# Altium schematic sheet MCU.SchDoc
size A3; SheetNumber: 4; SheetTotal: 6
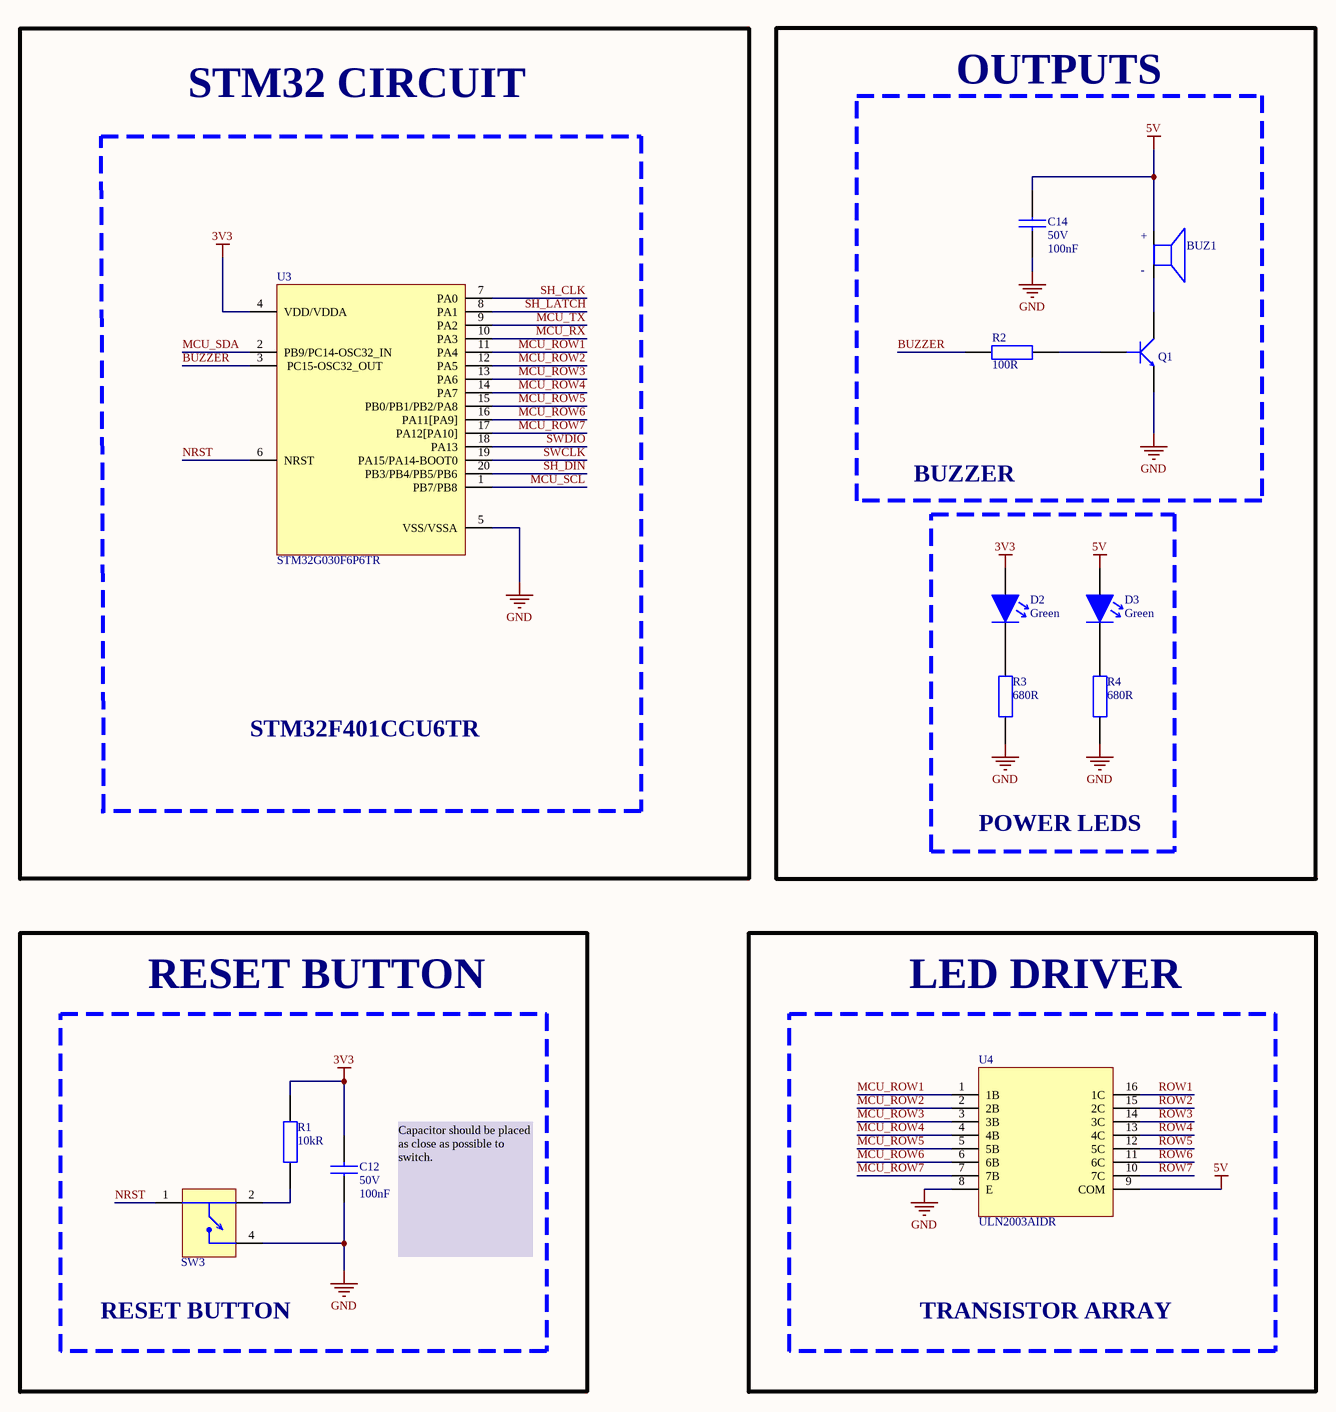
[diagram p0: MCU.SchDoc]

## Parts
BUZ1  SMI-1027-TW-5V-R  [BUZZER_SMD]  (value not drawn)
C12  Voltage Rating (DC): 50V  Capacitance: 100nF  [CAP_0603]  (hidden comment: C0603C104K5RACTU)
C14  Voltage Rating (DC): 50V  Capacitance: 100nF  [CAP_0603]  (hidden comment: C0603C104K5RACTU)
D2  Color: Green  [LED_GREEN_0805]  (hidden comment: LTST-C171GKT)
D3  Color: Green  [LED_GREEN_0805]  (hidden comment: LTST-C171GKT)
Q1  MMBT3904-7-F  [SOT-23F]  (value not drawn)
R1  Resistance: 10kR  [RES_0805]  (hidden comment: RC0805JR-0710KL)
R2  Resistance: 100R  [RES_0603]  (hidden comment: RC0603JR-07100RL)
R3  Resistance: 680R  [RES_1206]  (hidden comment: RC1206FR-07680RL)
R4  Resistance: 680R  [RES_1206]  (hidden comment: RC1206FR-07680RL)
SW3  PTS815 SJK 250 SMTR LFS  [BUTTON SMD]  (value not drawn)
U3  STM32G030F6P6TR  [TSSOP20]
U4  ULN2003AIDR  [16-SOIC]

## Blocks framed on the sheet
BUZZER: BUZ1 C14 Q1 R2
STM32F401CCU6TR: U3
POWER LEDS: D2 D3 R3 R4
RESET BUTTON: C12 R1 SW3
TRANSISTOR ARRAY: U4

## Nets
3V3: C12.2 D2.1 R1.2 U3.4(VDD/VDDA)
5V: BUZ1.P(POS) C14.1 D3.1 U4.9(COM)
GND: C12.1 C14.2 Q1.2(E) R3.1 R4.1 SW3.4 U3.5(VSS/VSSA) U4.8(E)
BUZZER: R2.1 U3.3(PC15-OSC32_OUT)
MCU_ROW1: U3.11(PA4) U4.1(1B)
MCU_ROW2: U3.12(PA5) U4.2(2B)
MCU_ROW3: U3.13(PA6) U4.3(3B)
MCU_ROW4: U3.14(PA7) U4.4(4B)
MCU_ROW5: U3.15(PB0/PB1/PB2/PA8) U4.5(5B)
MCU_ROW6: U3.16(PA11[PA9]) U4.6(6B)
MCU_ROW7: U3.17(PA12[PA10]) U4.7(7B)
MCU_RX: U3.10(PA3)
MCU_SCL: U3.1(PB7/PB8)
MCU_SDA: U3.2(PB9/PC14-OSC32_IN)
MCU_TX: U3.9(PA2)
NRST: SW3.1 U3.6(NRST)
ROW1: U4.16(1C)
ROW2: U4.15(2C)
ROW3: U4.14(3C)
ROW4: U4.13(4C)
ROW5: U4.12(5C)
ROW6: U4.11(6C)
ROW7: U4.10(7C)
SH_CLK: U3.7(PA0)
SH_DIN: U3.20(PB3/PB4/PB5/PB6)
SH_LATCH: U3.8(PA1)
SWCLK: U3.19(PA15/PA14-BOOT0)
SWDIO: U3.18(PA13)
NetBUZ1_N: BUZ1.N(NEG) Q1.3(C)
NetD2_2: D2.2 R3.2
NetD3_2: D3.2 R4.2
NetQ1_1: Q1.1(B) R2.2
NetR1_1: R1.1 SW3.2

## Notes on the sheet
- STM32 CIRCUIT
- OUTPUTS
- RESET BUTTON
- LED DRIVER
- Capacitor should be placed as close as possible to switch.
- DOSYA ADI / FILE NAME
- TANIM / DESCRIPTION
- HAZIRLAYAN / PREPARED BY
- YAYIN TARİHİ / REL. DATE
- BOYUT / SIZE
- SAYFA / SHEET
- /
- (in symbol BUZZER_5V_SMD) +; -

## Library data of the parts
BUZ1 = BUZZER_5V_SMD: Audio Indicator 5V 30mA 80dBA 2.7KHz Resonant Frequency SMD; Manufacturer: Projects Unlimited; DesignedBy: Aslı Kurt; Supplier 1: Farnell; Manufacturer Part Number: SMI-1027-TW-5V-R; RoHS: Yes; Category: Audio Products; Stock 1: 586; Pricing 1: 1=3,65, 10=2,48, 50=2,34, 100=2,19, 200=2,04, 600=2, 3000=1,96, 6000=1,92 (EUR); ComponentLink1URL: http://www.puiaudio.com/pdf/SMI-1027-TW-5V-R.pdf?src-supplier=Digikey; ComponentLink1Description: http://www.puiaudio.com/pdf/SMI-1027-TW-5V-R.pdf?src-supplier=Digikey; ComponentLink2URL: https://datasheet.octopart.com/SMI-1027-TW-5V-R-PUI-Audio-datasheet-142096096.pdf?src-supplier=Sager+Electronics; ComponentLink2Description: https://datasheet.octopart.com/SMI-1027-TW-5V-R-PUI-Audio-datasheet-142096096.pdf?src-supplier=Sager+Electronics; Supplier 2: Farnell; Stock 2: 586; Pricing 2: 150=2,19, 200=2,04, 600=2, 3000=1,96, 6000=1,92 (EUR); Supplier 3: Mouser; Stock 3: 655; Pricing 3: 1=3,48, 10=2,88, 50=2,5, 100=2,34, 1000=2,12, 10000=2,09 (USD); Supplier 4: Digikey; Stock 4: 10957; Pricing 4: 1=3,48, 10=2,877, 25=2,6548, 50=2,4932, 100=2,338, 250=2,17212, 600=1,92018 (USD); Supplier Part Number 1: 4411206; Supplier Part Number 2: 4411206RL; Supplier Part Number 3: 665-SMI1027TW5VR; Supplier Part Number 4: 668-1537-1-ND
C12 C14 = CAP CER 100nF 0603: CAP CER 100nF %10 0603 SMD; Manufacturer: KEMET; DesignedBy: Aslı Kurt; Dielectric Material: Ceramic; Tolerance: 10%; Dielectric: X7R; Dissipation Factor: 2.5%; Supplier 1: Digi-Key; Manufacturer Part Number: C0603C104K5RACTU; RoHS: Yes; Category: Ceramic Capacitors; Stock 1: 1666186; Pricing 1: 1=0,12000, 10=0,08500, 50=0,04620, 100=0,03770, 500=0,02696, 1000=0,02118 (USD); Mount: Surface Mount; Case/Package: 0603; Number of Pins: 2; Case Code (Metric): 1608; Case Code (Imperial): 0603; Contact Plating: Tin,Matte; Min Operating Temperature: -55°C; Max Operating Temperature: 125°C; Packaging: Tape and Reel; Package Quantity: 1; Termination: SMD/SMT; Voltage: 50V; Voltage Rating: 50V; Series: SMD Comm X7R; Length: 0.063inch; Width: 0.031inch; Height: 0.8mm; Thickness: 0.034inch; Lead Pitch: 0.7mm; Depth: 0.8mm; Radiation Hardening: No; RoHS Compliant: Yes; REACH SVHC: No SVHC; ComponentLink1URL: https://datasheet.ciiva.com/7823/kem-c1002-x7r-smd-7823591.pdf?src-supplier=Element14; ComponentLink1Description: https://datasheet.ciiva.com/7823/kem-c1002-x7r-smd-7823591.pdf?src-supplier=Element14; ComponentLink2URL: https://datasheet.ciiva.com/14602/70095383-14602583.pdf?src-supplier=Allied+Electronics; ComponentLink2Description: https://datasheet.ciiva.com/14602/70095383-14602583.pdf?src-supplier=Allied+Electronics; ComponentLink3URL: https://datasheet.ciiva.com/5999/kem-c1002-x7r-smd-5999400.pdf?src-supplier=Farnell; ComponentLink3Description: https://datasheet.ciiva.com/5999/kem-c1002-x7r-smd-5999400.pdf?src-supplier=Farnell; ComponentLink4URL: https://datasheet.ciiva.com/7823/kem-c1002-x7r-smd-7823592.pdf?src-supplier=Element14; ComponentLink4Description: https://datasheet.ciiva.com/7823/kem-c1002-x7r-smd-7823592.pdf?src-supplier=Element14; ComponentLink5URL: https://datasheet.ciiva.com/28645/1851736-28645640.pdf?src-supplier=Element14; ComponentLink5Description: https://datasheet.ciiva.com/28645/1851736-28645640.pdf?src-supplier=Element14; ComponentLink6URL: https://datasheet.ciiva.com/14585/70095383-14585209.pdf?src-supplier=Allied+Electronics; ComponentLink6Description: https://datasheet.ciiva.com/14585/70095383-14585209.pdf?src-supplier=Allied+Electronics; Supplier Part Number 1: 399-5089-1-ND
D2 D3 = LED GREEN 0805: Green 0805 130 º Min 5 mcd Typical 12 mcd Water Clear Lens SMT LED; Manufacturer: Vishay Lite-On; DesignedBy: Aslı Kurt; Lens Color: Colorless; Viewing Angle: 130°; Lens Style: Diffused,Colorless,Rectangular,Clear; Luminous Intensity: 12mcd; Forward Current: 30mA; Forward Voltage: 2.1V; Power Rating: 100mW; Dominant Wavelength: 569nm; Test Current: 10mA; Number of Elements: 1; Wavelength: 585nm; Reverse Voltage: 5V; Supplier 1: Digi-Key; Manufacturer Part Number: LTST-C171GKT; RoHS: Yes; Category: LEDs; Stock 1: 159023; Pricing 1: 1=0,26000, 10=0,14100, 100=0,06560, 500=0,06060, 1000=0,04747 (USD); Mount: Surface Mount; Case/Package: 0805; Number of Pins: 2; Case Code (Metric): 2012; Case Code (Imperial): 0805; Min Operating Temperature: -55°C; Max Operating Temperature: 85°C; Package Quantity: 1; Packaging: Tape and Reel; Illumination Color: Green; Lens Transparency: Clear; Power Dissipation: 100mW; Number of LEDs: 1; Series: CHIPLED 0805; Length: 2mm; Width: 1.25mm; Height: 0.8mm; Depth: 1.25mm; Radiation Hardening: No; Lead Free: Lead Free; RoHS Compliant: Yes; ComponentLink1URL: https://datasheet.ciiva.com/2110/ltst-c171gkt-2110000.pdf?src-supplier=Digi-Key; ComponentLink1Description: https://datasheet.ciiva.com/2110/ltst-c171gkt-2110000.pdf?src-supplier=Digi-Key; ComponentLink2URL: https://datasheet.ciiva.com/11773/0900766b80dc0296-11773991.pdf?src-supplier=RSComponents; ComponentLink2Description: https://datasheet.ciiva.com/11773/0900766b80dc0296-11773991.pdf?src-supplier=RSComponents; ComponentLink3URL: https://datasheet.ciiva.com/12400/lite-on-ltst-c171gkt-190133-12400647.pdf?src-supplier=Mouser; ComponentLink3Description: https://datasheet.ciiva.com/12400/lite-on-ltst-c171gkt-190133-12400647.pdf?src-supplier=Mouser; ComponentLink4URL: https://datasheet.ciiva.com/2110/ltst-c171gkt-2110001.pdf?src-supplier=Digi-Key; ComponentLink4Description: https://datasheet.ciiva.com/2110/ltst-c171gkt-2110001.pdf?src-supplier=Digi-Key; ComponentLink5URL: https://datasheet.ciiva.com/2110/ltst-c171gkt-2110002.pdf?src-supplier=Digi-Key; ComponentLink5Description: https://datasheet.ciiva.com/2110/ltst-c171gkt-2110002.pdf?src-supplier=Digi-Key; ComponentLink6URL: https://datasheet.ciiva.com/16396/ltst-c171gkt-16396549.pdf?src-supplier=Future+Electronics; ComponentLink6Description: https://datasheet.ciiva.com/16396/ltst-c171gkt-16396549.pdf?src-supplier=Future+Electronics; Supplier Part Number 1: 160-1423-1-ND
Q1 = MMBT3904-7-F: Transistor General Purpose BJT NPN 40 Volt 0.2A Automotive 3-Pin SOT-23; Manufacturer: Diodes Zetex; DesignedBy: Aslı Kurt; Max Power Dissipation: 300mW; Collector Emitter Voltage (VCEO): 40V; Max Collector Current: 200mA; Collector Base Voltage (VCBO): 60V; Frequency: 300MHz; hFE Min: 100; Number of Elements: 1; Emitter Base Voltage (VEBO): 6V; Collector Emitter Saturation Voltage: 300mV; Power Dissipation: 350mW; Element Configuration: Single; Supplier 1: Digi-Key; Manufacturer Part Number: MMBT3904-7-F; RoHS: Yes; Category: BJTs; Stock 1: 2393281; Pricing 1: 1=0,12000, 10=0,08600, 25=0,08280, 100=0,04660, 500=0,03664, 1000=0,02544 (USD); Mount: Surface Mount; Case/Package: SOT-23; Number of Pins: 3; Weight: 0.000282oz; Contact Plating: Tin,Matte; Min Operating Temperature: -55°C; Max Operating Temperature: 150°C; Polarity: NPN; Packaging: Tape and Reel; Package Quantity: 3000; Transition Frequency: 300MHz; Collector Emitter Breakdown Voltage: 40V; Max Breakdown Voltage: 40V; Continuous Collector Current: 200mA; Max Frequency: 300MHz; Gain Bandwidth Product: 300MHz; Series: -; Collector-emitter Voltage-Max: 300mV; Voltage Rating (DC): 40V; Length: 3.05mm; Width: 1.4mm; Height: 1mm; Radiation Hardening: No; REACH SVHC: No SVHC; Lead Free: Lead Free; RoHS Compliant: Yes; ComponentLink1URL: https://datasheet.ciiva.com/11201/ds30036-11201778.pdf?src-supplier=Avnet; ComponentLink1Description: https://datasheet.ciiva.com/11201/ds30036-11201778.pdf?src-supplier=Avnet; ComponentLink2URL: https://datasheet.ciiva.com/15138/getdatasheetpartid-53265-15138780.pdf?src-supplier=Verical; ComponentLink2Description: https://datasheet.ciiva.com/15138/getdatasheetpartid-53265-15138780.pdf?src-supplier=Verical; ComponentLink3URL: https://datasheet.ciiva.com/6361/ds30036-6361254.pdf?src-supplier=Digi-Key; ComponentLink3Description: https://datasheet.ciiva.com/6361/ds30036-6361254.pdf?src-supplier=Digi-Key; ComponentLink4URL: https://datasheet.ciiva.com/22711/1915516-22711750.pdf?src-supplier=Element14; ComponentLink4Description: https://datasheet.ciiva.com/22711/1915516-22711750.pdf?src-supplier=Element14; ComponentLink5URL: https://datasheet.ciiva.com/11198/ds30036-11198999.pdf?src-supplier=Avnet; ComponentLink5Description: https://datasheet.ciiva.com/11198/ds30036-11198999.pdf?src-supplier=Avnet; ComponentLink6URL: https://datasheet.ciiva.com/6361/ds30036-6361256.pdf?src-supplier=Digi-Key; ComponentLink6Description: https://datasheet.ciiva.com/6361/ds30036-6361256.pdf?src-supplier=Digi-Key; Supplier Part Number 1: MMBT3904-FDIDKR-ND
R1 = RES 10K OHM 08051/8W: RES 10K OHM 5% 1/8W 0805; Manufacturer: Yageo; DesignedBy: Aslı Kurt; Power Rating: 125mW; Temperature Coefficient: 100ppm/°C; Voltage Rating: 150V; Supplier 1: Digikey; Manufacturer Part Number: RC0805JR-0710KL; RoHS: Yes; Category: Chip SMD Resistors; Stock 1: 444162; Pricing 1: 1=0,1, 10=0,023, 50=0,0144, 100=0,012, 500=0,00818, 1000=0,00706 (USD); Case/Package: 0805; Contact Plating: Tin,Matte; Case Code (Imperial): 0805; Case Code (Metric): 2012; Size Code: 0805; Min Operating Temperature: -55°C; Max Operating Temperature: 155°C; Resistor Type: Thick Film; Tolerance: 5%; Packaging: Tape and Reel; Termination: SMD/SMT; Features: Moisture Resistant; Series: RC; Max Power Dissipation: 125mW; Number of Terminations: 2; Resistance Tolerance: 5%; Construction: Rectangular; Length: 2mm; Width: 1.25mm; Height: 0.5mm; Depth: 1.25mm; Radiation Hardening: No; RoHS Compliant: Yes; Military Standard: Not; Reach SVHC Compliant: Unknown; Lead Free: 5697LeadFree; ComponentLink1URL: https://datasheet.ciiva.com/7983/444164-7983765.pdf?src-supplier=Element14; ComponentLink1Description: https://datasheet.ciiva.com/7983/444164-7983765.pdf?src-supplier=Element14; ComponentLink2URL: https://datasheet.ciiva.com/7941/444164-7941870.pdf?src-supplier=Element14; ComponentLink2Description: https://datasheet.ciiva.com/7941/444164-7941870.pdf?src-supplier=Element14; ComponentLink3URL: https://datasheet.ciiva.com/7941/444164-7941871.pdf?src-supplier=Element14; ComponentLink3Description: https://datasheet.ciiva.com/7941/444164-7941871.pdf?src-supplier=Element14; Supplier Part Number 1: 311-10KARCT-ND
R2 = RES 100 OHM 0603 1/10W: RES 100 %5 OHM 0603 SMD; Manufacturer: Yageo; DesignedBy: Aslı Kurt; Tolerance: 5%; Temperature Coefficient: 100ppm/°C; Voltage Rating (DC): 50V; Power Rating: 100mW; Supplier 1: Digi-Key; Manufacturer Part Number: RC0603JR-07100RL; RoHS: Yes; Category: Chip SMD Resistors; Stock 1: 4334796; Pricing 1: 1=0,10000, 10=0,01900, 100=0,00770, 1000=0,00344, 2500=0,00298 (USD); Case/Package: 0603; Number of Pins: 2; Contact Plating: Tin,Matte; Case Code (Imperial): 0603; Case Code (Metric): 1608; Size Code: 0603; Min Operating Temperature: -55°C; Max Operating Temperature: 155°C; Resistor Type: Thick Film; Packaging: Tape and Reel; Voltage Rating: 50V; Termination: SMD/SMT; Features: Moisture Resistant; Series: RC; Max Power Dissipation: 100mW; Number of Terminations: 2; Construction: Rectangular; Resistance Tolerance: 5%; Length: 1.6mm; Width: 0.8mm; Depth: 0.8mm; Radiation Hardening: No; REACH SVHC: Unknown; Lead Free: Lead Free; Military Standard: Not; RoHS Compliant: Yes; ComponentLink1URL: https://datasheet.ciiva.com/15189/getdatasheetpartid-325207-15189846.pdf?src-supplier=Verical; ComponentLink1Description: https://datasheet.ciiva.com/15189/getdatasheetpartid-325207-15189846.pdf?src-supplier=Verical; ComponentLink2URL: https://datasheet.ciiva.com/8883/pyu-rc0603-51-rohs-l-4-8883047.pdf?src-supplier=Avnet; ComponentLink2Description: https://datasheet.ciiva.com/8883/pyu-rc0603-51-rohs-l-4-8883047.pdf?src-supplier=Avnet; ComponentLink3URL: https://datasheet.ciiva.com/7746/443971-7746425.pdf?src-supplier=Element14; ComponentLink3Description: https://datasheet.ciiva.com/7746/443971-7746425.pdf?src-supplier=Element14; ComponentLink4URL: https://datasheet.ciiva.com/7746/443971-7746426.pdf?src-supplier=Element14; ComponentLink4Description: https://datasheet.ciiva.com/7746/443971-7746426.pdf?src-supplier=Element14; Supplier Part Number 1: 311-100GRCT-ND
R3 R4 = RES 680 OHM 1206 1/4W: SMD Chip Resistor, 680 Ohm, ï¿½ 1%, 250 mW, 1206 [3216 Metric], Thick Film, General Purpose; Manufacturer: Yageo; Voltage Rating (AC): 200V; DesignedBy: Aslı Kurt; Supplier 1: Future Electronics; Manufacturer Part Number: RC1206FR-07680RL; RoHS: Yes; Category: Chip SMD Resistors; Stock 1: 315000; Pricing 1: 5000=0,0057, 20000=0,0055, 75000=0,0052, 200000=0,0051, 500000=0,0049 (USD); Lead Free: 5697LeadFree; ComponentLink1URL: https://datasheet.ciiva.com/11819/0900766b80c6630a-11819964.pdf?src-supplier=Rs; ComponentLink1Description: https://datasheet.ciiva.com/11819/0900766b80c6630a-11819964.pdf?src-supplier=Rs; ComponentLink2URL: https://datasheet.ciiva.com/7857/444357-7857386.pdf?src-supplier=Element14; ComponentLink2Description: https://datasheet.ciiva.com/7857/444357-7857386.pdf?src-supplier=Element14; ComponentLink3URL: https://datasheet.ciiva.com/7857/1686128-7857387.pdf?src-supplier=Element14; ComponentLink3Description: https://datasheet.ciiva.com/7857/1686128-7857387.pdf?src-supplier=Element14; ComponentLink4URL: https://datasheet.ciiva.com/7857/444357-7857388.pdf?src-supplier=Element14; ComponentLink4Description: https://datasheet.ciiva.com/7857/444357-7857388.pdf?src-supplier=Element14; ComponentLink5URL: https://datasheet.ciiva.com/46445/444357-46445718.pdf?src-supplier=Element14; ComponentLink5Description: https://datasheet.ciiva.com/46445/444357-46445718.pdf?src-supplier=Element14; ComponentLink6URL: https://datasheet.ciiva.com/17422/pyu-rc1206-51-rohs-l-4-17422460.pdf?src-supplier=Future+Electronics; ComponentLink6Description: https://datasheet.ciiva.com/17422/pyu-rc1206-51-rohs-l-4-17422460.pdf?src-supplier=Future+Electronics; Supplier 2: Rs; Stock 2: 2900; Pricing 2: 100=0,012, 1000=0,007, 2500=0,005, 5000=0,005, 10000=0,005 (GBP); Supplier 3: Avnet; Stock 3: 8860; Pricing 3: 1=0,104, 25=0,026, 50=0,021, 100=0,016 (USD); Supplier 4: Arrow Electronics; Stock 4: 830000; Pricing 4: 5000=0,0058, 10000=0,005, 25000=0,005, 50000=0,0037, 125000=0,0036 (USD); Supplier 5: Digikey; Stock 5: 2188492; Pricing 5: 1=0,1, 10=0,026, 50=0,0204, 100=0,0153, 500=0,01276, 1000=0,0102 (USD); Supplier 6: Mouser; Stock 6: 54929; Pricing 6: 1=0,1, 10=0,018, 50=0,018, 100=0,015, 1000=0,009, 10000=0,005 (USD); Supplier Part Number 1: 8645095; Supplier Part Number 6: 603-RC1206FR-07680RL; Supplier Part Number 2: 1988442; Supplier Part Number 3: 49AK3834; Supplier Part Number 4: RC1206FR-07680RL; Supplier Part Number 5: 311-680FRCT-ND
SW3 = 4.2mm x 3.2mm BUTTON: Microminiature Top Actuated Tactile Switch Momentary SPST-NO 50mA 12VDC Surface Mount T/R; Manufacturer: ITT C&K; Contact Resistance: 100mR; Number of Positions: 2NUMBER; DesignedBy: Aslı Kurt; Supplier 1: Digikey; Manufacturer Part Number: PTS815SJK250SMTRLFS; RoHS: Yes; Category: Tactile Switches; Stock 1: 21205; Pricing 1: 1=0,22, 10=0,208, 25=0,1972, 100=0,1786, 250=0,1628, 500=0,1513, 1000=0,12908 (USD); ComponentLink1URL: http://datasheet.octopart.com/PTS815SJK250SMTRLFS-C%26K-Components-datasheet-130077068.pdf?src-supplier=Mouser; ComponentLink1Description: http://datasheet.octopart.com/PTS815SJK250SMTRLFS-C%26K-Components-datasheet-130077068.pdf?src-supplier=Mouser; ComponentLink2URL: http://datasheet.octopart.com/PTS815SJK250SMTRLFS-C%26K-Components-datasheet-130077068.pdf?src-supplier=Newark; ComponentLink2Description: http://datasheet.octopart.com/PTS815SJK250SMTRLFS-C%26K-Components-datasheet-130077068.pdf?src-supplier=Newark; ComponentLink3URL: http://datasheet.octopart.com/PTS815SJK250SMTRLFS-C%26K-Components-datasheet-130077068.pdf?src-supplier=Allied+Electronics; ComponentLink3Description: http://datasheet.octopart.com/PTS815SJK250SMTRLFS-C%26K-Components-datasheet-130077068.pdf?src-supplier=Allied+Electronics; ComponentLink4URL: http://datasheet.octopart.com/PTS815SJK250SMTRLFS-C%26K-Components-datasheet-130077068.pdf?src-supplier=Onlinecomponents.com; ComponentLink4Description: http://datasheet.octopart.com/PTS815SJK250SMTRLFS-C%26K-Components-datasheet-130077068.pdf?src-supplier=Onlinecomponents.com; ComponentLink5URL: http://datasheet.octopart.com/PTS815SJK250SMTRLFS-C%26K-Components-datasheet-130077068.pdf?src-supplier=Verical; ComponentLink5Description: http://datasheet.octopart.com/PTS815SJK250SMTRLFS-C%26K-Components-datasheet-130077068.pdf?src-supplier=Verical; ComponentLink6URL: http://datasheet.octopart.com/PTS815SJK250SMTRLFS-C%26K-Components-datasheet-130077068.pdf?src-supplier=Future+Electronics; ComponentLink6Description: http://datasheet.octopart.com/PTS815SJK250SMTRLFS-C%26K-Components-datasheet-130077068.pdf?src-supplier=Future+Electronics; ComponentLink7URL: http://datasheet.octopart.com/PTS815SJK250SMTRLFS-C%26K-Components-datasheet-130077068.pdf?src-supplier=Digikey; ComponentLink7Description: http://datasheet.octopart.com/PTS815SJK250SMTRLFS-C%26K-Components-datasheet-130077068.pdf?src-supplier=Digikey; ComponentLink8URL: http://datasheet.octopart.com/PTS815SJK250SMTRLFS-C%26K-Components-datasheet-130077068.pdf?src-supplier=Avnet; ComponentLink8Description: http://datasheet.octopart.com/PTS815SJK250SMTRLFS-C%26K-Components-datasheet-130077068.pdf?src-supplier=Avnet; ComponentLink9URL: http://datasheet.octopart.com/PTS815SJK250SMTRLFS-C%26K-Components-datasheet-130077068.pdf?src-supplier=Sager+Electronics; ComponentLink9Description: http://datasheet.octopart.com/PTS815SJK250SMTRLFS-C%26K-Components-datasheet-130077068.pdf?src-supplier=Sager+Electronics; ComponentLink10URL: http://datasheet.octopart.com/PTS815SJK250SMTRLFS-C%26K-Components-datasheet-130077068.pdf?src-supplier=NAC+Semi; ComponentLink10Description: http://datasheet.octopart.com/PTS815SJK250SMTRLFS-C%26K-Components-datasheet-130077068.pdf?src-supplier=NAC+Semi; ComponentLink11URL: http://datasheet.octopart.com/PTS815SJK250SMTRLFS-C%26K-Components-datasheet-130077068.pdf?src-supplier=LCSC; ComponentLink11Description: http://datasheet.octopart.com/PTS815SJK250SMTRLFS-C%26K-Components-datasheet-130077068.pdf?src-supplier=LCSC; ComponentLink12URL: http://datasheet.octopart.com/PTS815SJK250SMTRLFS-C%26K-Components-datasheet-130077068.pdf?src-supplier=Electro+Sonic; ComponentLink12Description: http://datasheet.octopart.com/PTS815SJK250SMTRLFS-C%26K-Components-datasheet-130077068.pdf?src-supplier=Electro+Sonic; ComponentLink13URL: http://datasheet.octopart.com/PTS815SJK250SMTRLFS-C%26K-Components-datasheet-130077068.pdf?src-supplier=TTI; ComponentLink13Description: http://datasheet.octopart.com/PTS815SJK250SMTRLFS-C%26K-Components-datasheet-130077068.pdf?src-supplier=TTI; ComponentLink14URL: https://datasheet.octopart.com/PTS815SJK250SMTRLFS-C%26K-Components-datasheet-166147782.pdf?src-supplier=TME; ComponentLink14Description: https://datasheet.octopart.com/PTS815SJK250SMTRLFS-C%26K-Components-datasheet-166147782.pdf?src-supplier=TME; Supplier Part Number 1: CKN12216-1-ND
U3 = STM32G030F6P6TR: MCU 32-bit ARM Cortex M0+ RISC 32KB Flash 2.5V/3.3V 20-Pin TSSOP T/R; Manufacturer: STMicroelectronics; DesignedBy: Aslı Kurt; Supplier 1: Future Electronics; Manufacturer Part Number: STM32G030F6P6TR; RoHS: Yes; Category: Microcontrollers; Stock 1: 82500; Pricing 1: 2500=0,665, 5000=0,64 (USD); RoHS Compliant: Yes; ComponentLink1URL: https://datasheet.octopart.com/STM32G030F6P6TR-STMicroelectronics-datasheet-159144891.pdf?src-supplier=Newark; ComponentLink1Description: https://datasheet.octopart.com/STM32G030F6P6TR-STMicroelectronics-datasheet-159144891.pdf?src-supplier=Newark; ComponentLink2URL: https://datasheet.octopart.com/STM32G030F6P6TR-STMicroelectronics-datasheet-159144891.pdf?src-supplier=Farnell; ComponentLink2Description: https://datasheet.octopart.com/STM32G030F6P6TR-STMicroelectronics-datasheet-159144891.pdf?src-supplier=Farnell; ComponentLink3URL: https://www.st.com/resource/en/datasheet/stm32g030f6.pdf?src-supplier=Digikey; ComponentLink3Description: https://www.st.com/resource/en/datasheet/stm32g030f6.pdf?src-supplier=Digikey; Supplier 2: Future Electronics; Stock 2: 5000; Pricing 2: 2500=0,64 (USD); Supplier 3: Avnet; Stock 3: 2500; Pricing 3: 2500=0,65292 (USD); Supplier 4: Arrow Electronics; Stock 4: 184401; Pricing 4: 1=0,6826, 10=0,6427, 100=0,606, 250=0,5921, 500=0,5629, 1000=0,5344, 2500=0,5171, 10000=0,5051 (USD); Stock 5: 1160; Pricing 5: 1=1,27, 10=1,05, 50=0,951, 100=0,852, 250=0,815, 500=0,752, 1000=0,685, 2500=0,666 (EUR); Supplier 6: Rs; Stock 6: 1; Pricing 6: 5=0,562, 10=0,884, 100=0,868, 250=0,85, 500=0,834 (GBP); Supplier 7: Newark; Stock 7: 2291; Pricing 7: 1=1,35, 10=1,2, 25=1,16, 50=1,12, 100=1,07, 250=1,03, 500=0,945, 1000=0,836 (USD); Supplier 8: Digikey; Stock 8: 11147; Pricing 8: 1=1,61, 10=1,444, 25=1,362, 100=1,1604, 250=1,0896, 500=0,95338, 1000=0,78995 (USD); Supplier 9: Digikey; Stock 9: 11085; Pricing 9: 1=1,61, 10=1,444, 25=1,362, 100=1,1604, 250=1,0896, 500=0,95338, 1000=0,78995, 2500=0,73547, 5000=0,70823, 12500=0,68099 (USD); Supplier 10: Digikey; Stock 10: 7500; Pricing 10: 2500=0,73547, 5000=0,70823, 12500=0,68099 (USD); Supplier Part Number 1: 5132575; Supplier Part Number 2: 7132552; Supplier Part Number 3: STM32G030F6P6TR; Supplier Part Number 4: STM32G030F6P6TR; Supplier Part Number 5: 3933089; Supplier 5: Farnell; Supplier Part Number 6: 2396335; Supplier Part Number 7: 29AK8184; Supplier Part Number 8: 497-STM32G030F6P6TRDKR-ND; Supplier Part Number 9: 497-STM32G030F6P6TRCT-ND; Supplier Part Number 10: 497-STM32G030F6P6TR-ND
U4 = ULN2003AIDR: 50-V, 7-ch darlington transistor array, -40 to 105C 16-SOIC -40 to 105; Manufacturer: Texas Instruments; DesignedBy: Aslı Kurt; Voltage Rating (DC): 50V; Current Rating: 500mA; Number of Channels: 7NUMBER; Supplier 1: Mouser; Manufacturer Part Number: ULN2003AIDR; RoHS: Yes; Category: Integrated Circuits (ICs); Stock 1: 8393; Pricing 1: 1=0,7, 10=0,522, 50=0,522, 100=0,384, 1000=0,279, 10000=0,221 (USD); Output Voltage: 50V; Thickness: 1.58mm; Lead Free: 5697LeadFree; ComponentLink1URL: https://datasheet.ciiva.com/15139/getdatasheetpartid-47948-15139878.pdf?src-supplier=Verical; ComponentLink1Description: https://datasheet.ciiva.com/15139/getdatasheetpartid-47948-15139878.pdf?src-supplier=Verical; ComponentLink2URL: https://datasheet.ciiva.com/14424/ulq2003a-14424030.pdf?src-supplier=Avnet; ComponentLink2Description: https://datasheet.ciiva.com/14424/ulq2003a-14424030.pdf?src-supplier=Avnet; ComponentLink3URL: https://datasheet.ciiva.com/1700/uln2003ai-1700820.pdf?src-supplier=Digikey; ComponentLink3Description: https://datasheet.ciiva.com/1700/uln2003ai-1700820.pdf?src-supplier=Digikey; ComponentLink4URL: https://datasheet.ciiva.com/1700/uln2003ai-1700821.pdf?src-supplier=Digikey; ComponentLink4Description: https://datasheet.ciiva.com/1700/uln2003ai-1700821.pdf?src-supplier=Digikey; ComponentLink5URL: https://datasheet.ciiva.com/1700/uln2003ai-1700822.pdf?src-supplier=Digikey; ComponentLink5Description: https://datasheet.ciiva.com/1700/uln2003ai-1700822.pdf?src-supplier=Digikey; Supplier 2: Arrow Electronics; Stock 2: 4; Pricing 2: 1=0,3894, 10=0,3422, 25=0,2251 (USD); Supplier 3: Digikey; Stock 3: 16735; Pricing 3: 1=0,83, 10=0,558, 100=0,3833, 500=0,30422, 1000=0,27819 (USD); Supplier 4: Digikey; Stock 4: 16735; Pricing 4: 1=0,83, 10=0,558, 100=0,3833, 500=0,30422, 1000=0,27819 (USD); Supplier 5: Digikey; Stock 5: 15000; Pricing 5: 2500=0,24968, 5000=0,23188, 7500=0,22277, 12500=0,22125 (USD); Supplier Part Number 1: 595-ULN2003AIDR; Supplier Part Number 2: ULN2003AIDR; Supplier Part Number 3: 296-15407-1-ND; Supplier Part Number 4: 296-15407-6-ND; Supplier Part Number 5: 296-15407-2-ND